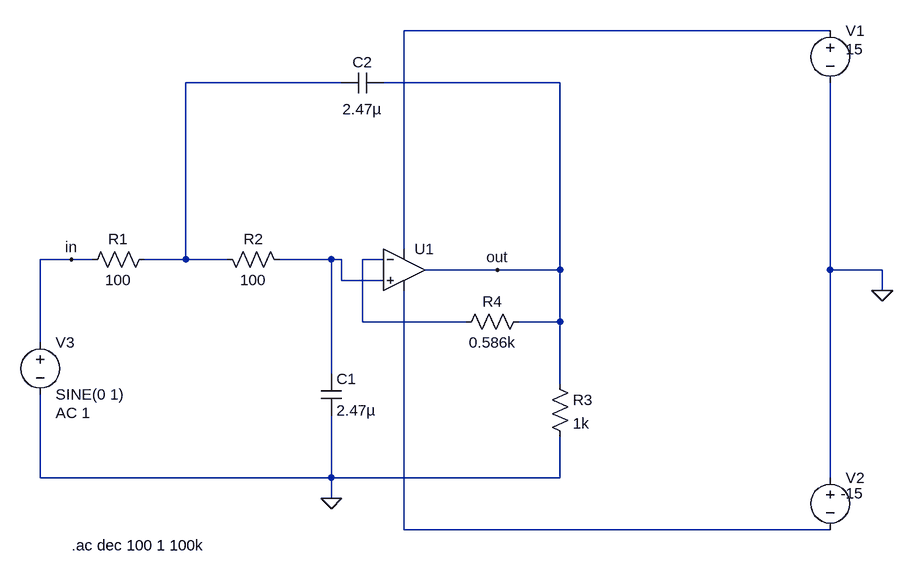
[diagram p0: schematic 02 Aktiver Tiefpass-Filter.asc]
02 Aktiver Tiefpass-Filter.asc, the LTspice schematic file:
Version 4
SHEET 1 1316 772
WIRE 1216 -192 560 -192
WIRE 464 -112 224 -112
WIRE 800 -112 528 -112
WIRE 560 144 560 -192
WIRE 48 160 0 160
WIRE 80 160 48 160
WIRE 224 160 224 -112
WIRE 224 160 160 160
WIRE 288 160 224 160
WIRE 448 160 368 160
WIRE 464 160 448 160
WIRE 528 160 496 160
WIRE 704 176 592 176
WIRE 800 176 800 -112
WIRE 800 176 704 176
WIRE 1216 176 1216 -112
WIRE 1296 176 1216 176
WIRE 464 192 464 160
WIRE 528 192 464 192
WIRE 1296 208 1296 176
WIRE 496 256 496 160
WIRE 656 256 496 256
WIRE 800 256 800 176
WIRE 800 256 736 256
WIRE 0 288 0 160
WIRE 448 336 448 160
WIRE 800 352 800 256
WIRE 0 496 0 368
WIRE 448 496 448 400
WIRE 448 496 0 496
WIRE 800 496 800 432
WIRE 800 496 448 496
WIRE 1216 496 1216 176
WIRE 448 528 448 496
WIRE 560 576 560 208
WIRE 1216 576 560 576
FLAG 448 528 0
FLAG 1296 208 0
FLAG 704 176 out
FLAG 48 160 in
SYMBOL res 176 144 R90
WINDOW 0 0 56 VBottom 2
WINDOW 3 32 56 VTop 2
SYMATTR InstName R1
SYMATTR Value 100
SYMBOL res 384 176 M270
WINDOW 0 32 56 VTop 2
WINDOW 3 0 56 VBottom 2
SYMATTR InstName R2
SYMATTR Value 100
SYMBOL cap 432 336 R0
SYMATTR InstName C1
SYMATTR Value 2.47µ
SYMBOL cap 528 -128 R90
WINDOW 0 0 32 VBottom 2
WINDOW 3 41 32 VTop 2
SYMATTR InstName C2
SYMATTR Value 2.47µ
SYMBOL res 784 336 R0
SYMATTR InstName R3
SYMATTR Value 1k
SYMBOL res 752 240 R90
WINDOW 0 0 56 VBottom 2
WINDOW 3 32 56 VTop 2
SYMATTR InstName R4
SYMATTR Value 0.586k
SYMBOL voltage 1216 -208 R0
WINDOW 3 24 44 Left 2
WINDOW 123 0 0 Left 0
WINDOW 39 0 0 Left 0
SYMATTR Value 15
SYMATTR InstName V1
SYMBOL voltage 1216 480 R0
WINDOW 123 0 0 Left 0
WINDOW 39 0 0 Left 0
WINDOW 3 16 40 Left 2
SYMATTR InstName V2
SYMATTR Value -15
SYMBOL voltage 0 272 R0
WINDOW 123 24 124 Left 2
WINDOW 39 0 0 Left 0
SYMATTR Value2 AC 1
SYMATTR InstName V3
SYMATTR Value SINE(0 1)
SYMBOL OpAmps\\UniversalOpAmp1 560 176 R0
SYMATTR InstName U1
TEXT 48 600 Left 2 !.ac dec 100 1 100k

The netlist it stands for:
* 02 Aktiver Tiefpass-Filter.asc
R1 N002 in 100
R2 N003 N002 100
C1 N003 0 2.47µ
C2 out N002 2.47µ
R3 out 0 1k
R4 out N004 0.586k
V1 N001 0 15
V2 0 N005 -15
V3 in 0 SINE(0 1) AC 1
XU1 N003 N004 N001 N005 out level1 Avol=1Meg GBW=10Meg Vos=0 En=0 Enk=0 In=0 Ink=0 Rin=500Meg  ; pins In+ In- V+ V- OUT
.ac dec 100 1 100k
.lib UniversalOpAmp1.lib
.backanno
.end